# Altium schematic sheet Motor_Ctl.SchDoc: Motor_Ctl
size A4; Organization: Altium Limited; Address1: L3, 12a Rodborough Rd; Address2: Frenchs Forest; Address3: NSW; Address4: Australia 2086; DocumentNumber: 6; SheetNumber: 6; SheetTotal: 8
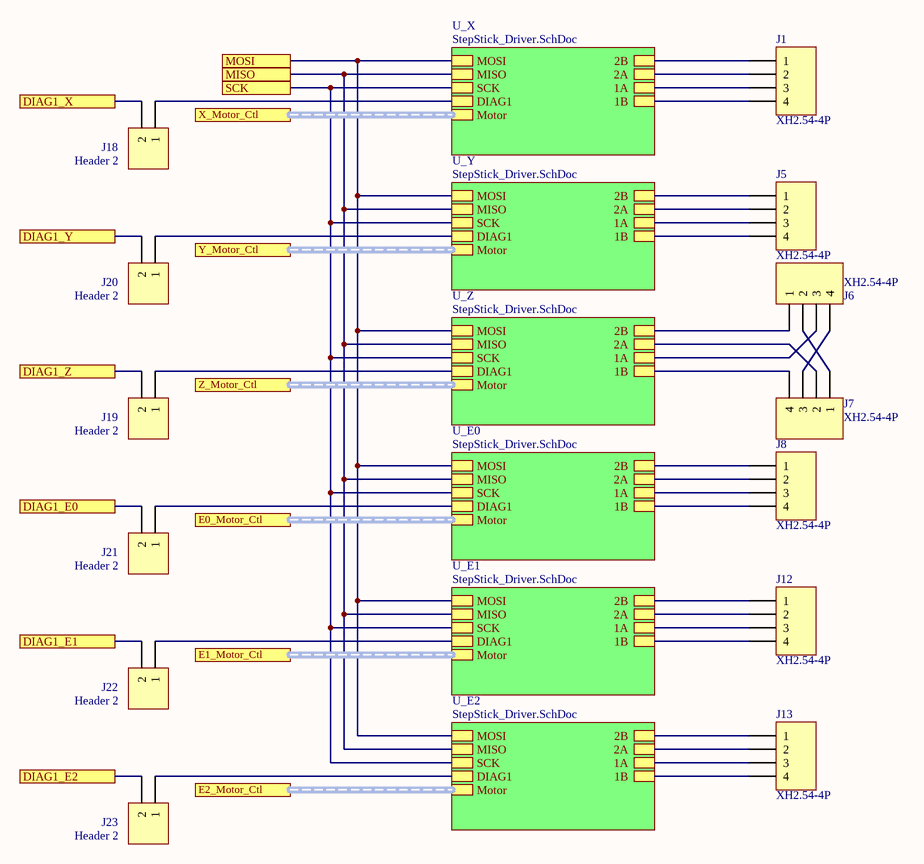
[diagram p0: Motor_Ctl.SchDoc]

## Parts
J1  XH2.54-4P  [1x4 MTE Straight Header 2.54mm]
J5  XH2.54-4P  [1x4 MTE Straight Header 2.54mm]
J6  XH2.54-4P  [1x4 MTE Straight Header 2.54mm]
J7  XH2.54-4P  [1x4 MTE Straight Header 2.54mm]
J8  XH2.54-4P  [1x4 MTE Straight Header 2.54mm]
J12  XH2.54-4P  [1x4 MTE Straight Header 2.54mm]
J13  XH2.54-4P  [1x4 MTE Straight Header 2.54mm]
J18  Header 2  [HDR1X2]
J19  Header 2  [HDR1X2]
J20  Header 2  [HDR1X2]
J21  Header 2  [HDR1X2]
J22  Header 2  [HDR1X2]
J23  Header 2  [HDR1X2]

## Sub-sheets
U_E0 = StepStick_Driver.SchDoc: 2B, 1B, 1A, 2A, MOSI, SCK, MISO, Motor (harness Motor), DIAG1
U_E1 = StepStick_Driver.SchDoc: 2B, 1B, 1A, 2A, MOSI, SCK, MISO, Motor (harness Motor), DIAG1
U_E2 = StepStick_Driver.SchDoc: 2B, 1B, 1A, 2A, MOSI, SCK, MISO, Motor (harness Motor), DIAG1
U_X = StepStick_Driver.SchDoc: 2B, 1B, 1A, 2A, MOSI, SCK, MISO, Motor (harness Motor), DIAG1
U_Y = StepStick_Driver.SchDoc: 2B, 1B, 1A, 2A, MOSI, SCK, MISO, Motor (harness Motor), DIAG1
U_Z = StepStick_Driver.SchDoc: 2B, 1B, 1A, 2A, MOSI, SCK, MISO, Motor (harness Motor), DIAG1

## Ports
DIAG1_E0, DIAG1_E1, DIAG1_E2, DIAG1_X, DIAG1_Y, DIAG1_Z, E0_Motor_Ctl (harness Motor), E1_Motor_Ctl (harness Motor), E2_Motor_Ctl (harness Motor), MISO, MOSI, SCK, X_Motor_Ctl (harness Motor), Y_Motor_Ctl (harness Motor), Z_Motor_Ctl (harness Motor)

## Nets
DIAG1_E0: J21.2 ; port DIAG1_E0
DIAG1_E1: J22.2 ; port DIAG1_E1
DIAG1_E2: J23.2 ; port DIAG1_E2
DIAG1_X: J18.2 ; port DIAG1_X
DIAG1_Y: J20.2 ; port DIAG1_Y
DIAG1_Z: J19.2 ; port DIAG1_Z
MISO: port MISO, sheet U_E1/MISO, sheet U_E0/MISO, sheet U_Z/MISO, sheet U_Y/MISO, sheet U_X/MISO, sheet U_E2/MISO
MOSI: port MOSI, sheet U_E1/MOSI, sheet U_E0/MOSI, sheet U_Z/MOSI, sheet U_Y/MOSI, sheet U_X/MOSI, sheet U_E2/MOSI
SCK: port SCK, sheet U_E1/SCK, sheet U_E0/SCK, sheet U_Z/SCK, sheet U_Y/SCK, sheet U_X/SCK, sheet U_E2/SCK
NetJ1_1: J1.1 ; sheet U_X/2B
NetJ1_2: J1.2 ; sheet U_X/2A
NetJ1_3: J1.3 ; sheet U_X/1A
NetJ1_4: J1.4 ; sheet U_X/1B
NetJ5_1: J5.1 ; sheet U_Y/2B
NetJ5_2: J5.2 ; sheet U_Y/2A
NetJ5_3: J5.3 ; sheet U_Y/1A
NetJ5_4: J5.4 ; sheet U_Y/1B
NetJ6_1: J6.1 ; sheet U_Z/2B
NetJ6_2: J6.2 J7.1
NetJ6_3: J6.3 ; sheet U_Z/1A
NetJ6_4: J6.4 J7.3
NetJ7_2: J7.2 ; sheet U_Z/2A
NetJ7_4: J7.4 ; sheet U_Z/1B
NetJ8_1: J8.1 ; sheet U_E0/2B
NetJ8_2: J8.2 ; sheet U_E0/2A
NetJ8_3: J8.3 ; sheet U_E0/1A
NetJ8_4: J8.4 ; sheet U_E0/1B
NetJ12_1: J12.1 ; sheet U_E1/2B
NetJ12_2: J12.2 ; sheet U_E1/2A
NetJ12_3: J12.3 ; sheet U_E1/1A
NetJ12_4: J12.4 ; sheet U_E1/1B
NetJ13_1: J13.1 ; sheet U_E2/2B
NetJ13_2: J13.2 ; sheet U_E2/2A
NetJ13_3: J13.3 ; sheet U_E2/1A
NetJ13_4: J13.4 ; sheet U_E2/1B
NetJ18_1: J18.1 ; sheet U_X/DIAG1
NetJ19_1: J19.1 ; sheet U_Z/DIAG1
NetJ20_1: J20.1 ; sheet U_Y/DIAG1
NetJ21_1: J21.1 ; sheet U_E0/DIAG1
NetJ22_1: J22.1 ; sheet U_E1/DIAG1
NetJ23_1: J23.1 ; sheet U_E2/DIAG1

## Buses and harness runs
harness port E0_Motor_Ctl = sheet U_E0/Motor
harness port E1_Motor_Ctl = sheet U_E1/Motor
harness port E2_Motor_Ctl = sheet U_E2/Motor
harness port X_Motor_Ctl = sheet U_X/Motor
harness port Y_Motor_Ctl = sheet U_Y/Motor
harness port Z_Motor_Ctl = sheet U_Z/Motor

## Notes on the sheet
- Title
- Size:
- Date:
- A4
- Number:
- Time:
- Revision:
- Sheet
- of
- File:

## Library data of the parts
J1 J5-J8 J12 J13 = Header 4: Header, 4-Pin; LatestRevisionDate: 17-Jul-2002; LatestRevisionNote: Re-released for DXP Platform.; Publisher: Altium Limited
J18-J23 = Header 2: Header, 2-Pin; LatestRevisionDate: 17-Jul-2002; LatestRevisionNote: Re-released for DXP Platform.; Publisher: Altium Limited